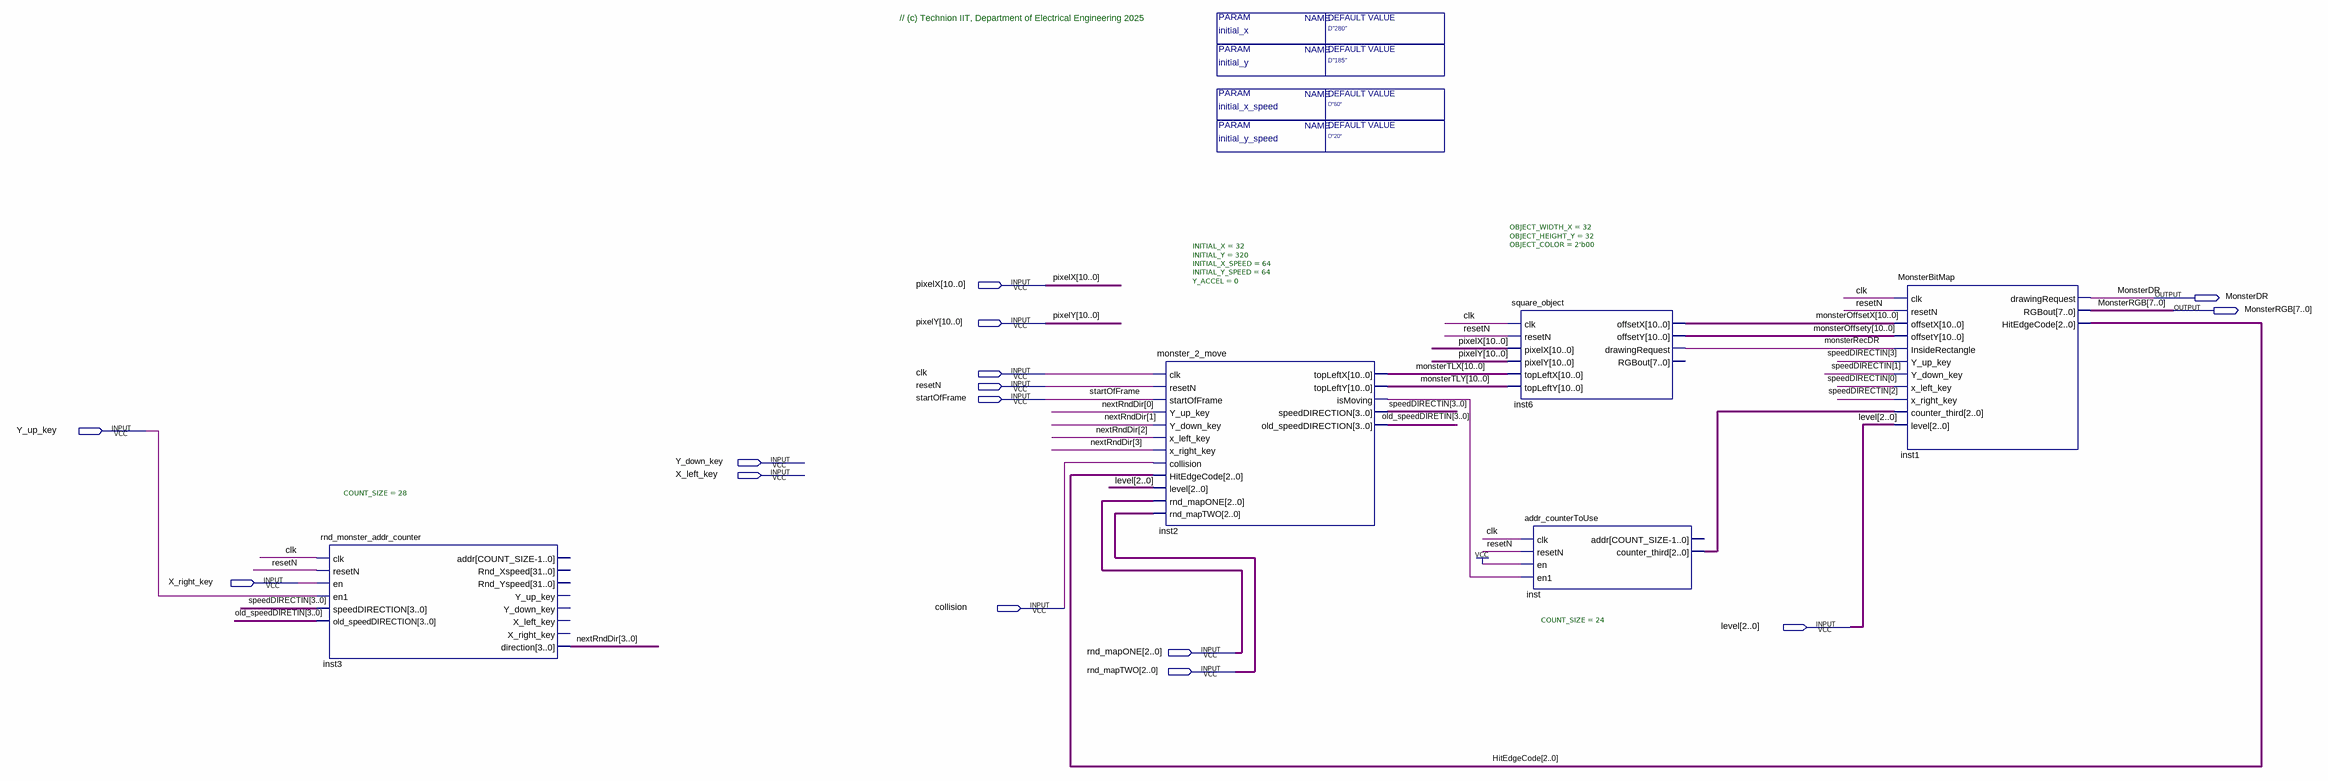
[diagram p0: schematic sheet]
// Quartus schematic Monster_2_Block_T.bdf as structural Verilog: 5 symbols, 15 pins
module Monster_2_Block_T #(parameter initial_x = "D\"280\"", parameter initial_y = "D\"185\"", parameter initial_x_speed = "D\"60\"", parameter initial_y_speed = "D\"20\"") (
  input  [10:0] pixelX,
  input  [10:0] pixelY,
  input  clk,
  input  resetN,
  input  startOfFrame,
  input  Y_up_key,
  input  Y_down_key,
  input  X_left_key,
  input  X_right_key,
  input  collision,
  input  [2:0] level,
  input  [2:0] rnd_mapONE,
  input  [2:0] rnd_mapTWO,
  output MonsterDR,
  output [7:0] MonsterRGB
);

  wire inst2_ismoving, monsterRecDR;
  wire [2:0] HitEdgeCode, inst_counter_third;
  wire [3:0] nextRndDir, old_speedDIRETIN, speedDIRECTIN;
  wire [10:0] monsterOffsetX, monsterOffsety, monsterTLX, monsterTLY;

  rnd_monster_addr_counter #(.COUNT_SIZE(28)) inst3 (
    .clk(clk), .resetN(resetN), .en(X_right_key), .en1(Y_up_key), .speedDIRECTION(speedDIRECTIN),
    .old_speedDIRECTION(old_speedDIRETIN), .direction(nextRndDir));  // open: addr, Rnd_Xspeed, Rnd_Yspeed, Y_up_key, Y_down_key, X_left_key, X_right_key
  monster_2_move #(.INITIAL_X(32), .INITIAL_Y(320), .INITIAL_X_SPEED(64), .INITIAL_Y_SPEED(64), .Y_ACCEL(0)) inst2 (
    .clk(clk), .resetN(resetN), .startOfFrame(startOfFrame), .Y_up_key(nextRndDir[0]),
    .Y_down_key(nextRndDir[1]), .x_left_key(nextRndDir[2]), .x_right_key(nextRndDir[3]),
    .collision(collision), .HitEdgeCode(HitEdgeCode), .level(level), .rnd_mapONE(rnd_mapONE),
    .rnd_mapTWO(rnd_mapTWO), .topLeftX(monsterTLX), .topLeftY(monsterTLY), .isMoving(inst2_ismoving),
    .speedDIRECTION(speedDIRECTIN), .old_speedDIRECTION(old_speedDIRETIN));
  square_object #(.OBJECT_WIDTH_X(32), .OBJECT_HEIGHT_Y(32), .OBJECT_COLOR(2'b00)) inst6 (
    .clk(clk), .resetN(resetN), .pixelX(pixelX), .pixelY(pixelY), .topLeftX(monsterTLX),
    .topLeftY(monsterTLY), .offsetX(monsterOffsetX), .offsetY(monsterOffsety), .drawingRequest(monsterRecDR));  // open: RGBout
  addr_counterToUse #(.COUNT_SIZE(24)) inst (
    .clk(clk), .resetN(resetN), .en(1'b1), .en1(inst2_ismoving), .counter_third(inst_counter_third));  // open: addr
  MonsterBitMap inst1 (
    .clk(clk), .resetN(resetN), .offsetX(monsterOffsetX), .offsetY(monsterOffsety),
    .InsideRectangle(monsterRecDR), .Y_up_key(speedDIRECTIN[3]), .Y_down_key(speedDIRECTIN[1]),
    .x_left_key(speedDIRECTIN[0]), .x_right_key(speedDIRECTIN[2]), .counter_third(inst_counter_third),
    .level(level), .drawingRequest(MonsterDR), .RGBout(MonsterRGB), .HitEdgeCode(HitEdgeCode));

  // Notes on the sheet:
  //   // (c) Technion IIT, Department of Electrical Engineering 2025
endmodule
